# EAGLE design BLEModule (EAGLE 7.6.0)
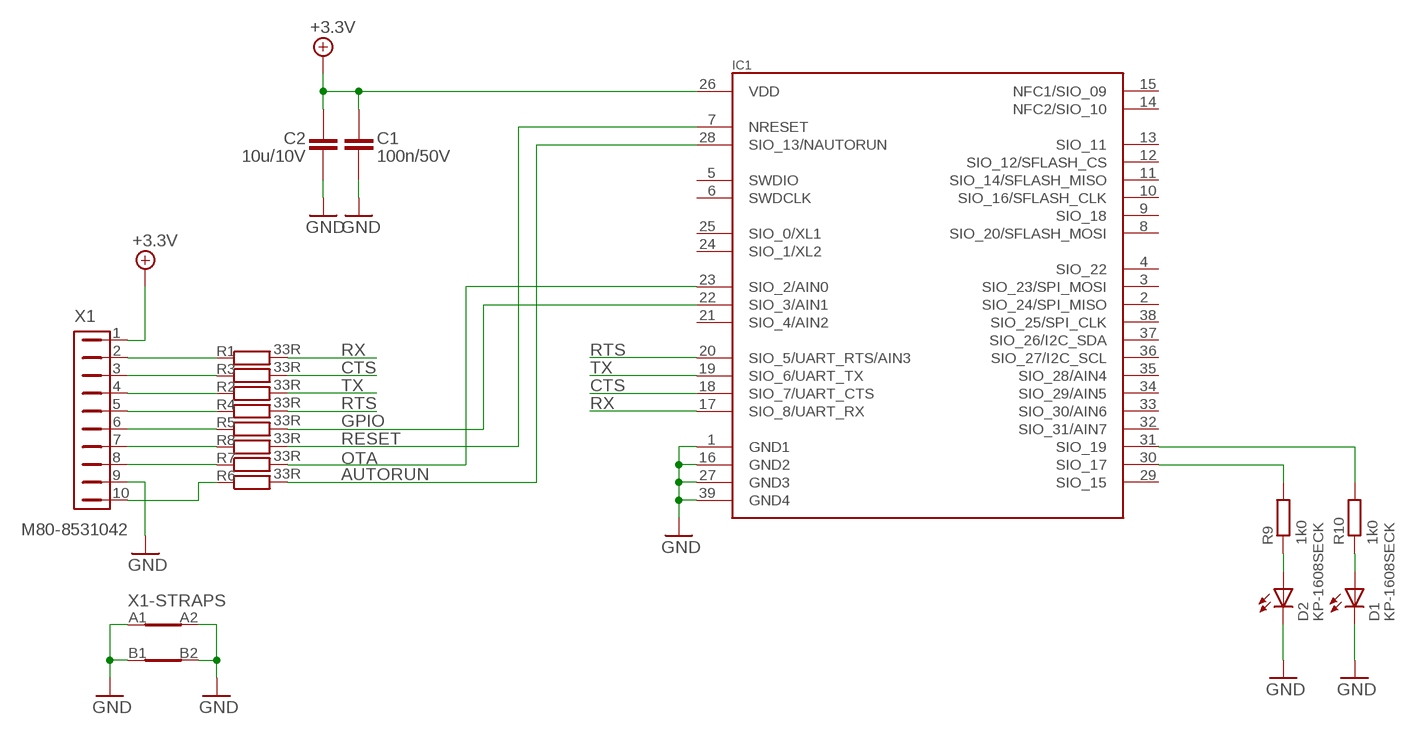
[diagram p0: schematic, sheet 1]

## Parts
C1  100N/50V,X7R,+/-10%_0603R  [C0603R]
C2  10U/10V,X5R,+/-20%_0603R  [C0603R]
D1  KP-1608SECK  [0603]
D2  KP-1608SECK  [0603]
IC1  BL652-SC-01  [BL652-SA]
R1  33R/0.1W,THICK_FILM,1%_0603R  [R0603R]
R2  33R/0.1W,THICK_FILM,1%_0603R  [R0603R]
R3  33R/0.1W,THICK_FILM,1%_0603R  [R0603R]
R4  33R/0.1W,THICK_FILM,1%_0603R  [R0603R]
R5  33R/0.1W,THICK_FILM,1%_0603R  [R0603R]
R6  33R/0.1W,THICK_FILM,1%_0603R  [R0603R]
R7  33R/0.1W,THICK_FILM,1%_0603R  [R0603R]
R8  33R/0.1W,THICK_FILM,1%_0603R  [R0603R]
R9  1K0/0.1W,THICK_FILM,1%_0603R  [R0603R]
R10  1K0/0.1W,THICK_FILM,1%_0603R  [R0603R]
X1  M80-8531042  M80-8531042-W_STRAPS  [M80-85310-W_STRAPS]

## Nets
+3.3V: C1.2 C2.2 IC1.26(VDD) X1.1
AUTORUN: IC1.28(SIO_13/NAUTORUN) R6.2
CTS: IC1.18(SIO_7/UART_CTS) R3.2
GND: C1.1 C2.1 D1.2(C) D2.2(C) IC1.1(GND1) IC1.16(GND2) IC1.27(GND3) IC1.39(GND4) X1.9 X1.A1 X1.A2 X1.B1 X1.B2
GPIO: IC1.22(SIO_3/AIN1) R5.2
N$1: R6.1 X1.10
N$2: R1.1 X1.2
N$3: R3.1 X1.3
N$4: R2.1 X1.4
N$5: R4.1 X1.5
N$6: R5.1 X1.6
N$7: R7.1 X1.8
N$8: R8.1 X1.7
N$10: D2.1(A) R9.1
N$12: D1.1(A) R10.1
N$13: IC1.30(SIO_17) R9.2
N$14: IC1.31(SIO_19) R10.2
OTA: IC1.23(SIO_2/AIN0) R7.2
RESET: IC1.7(NRESET) R8.2
RTS: IC1.20(SIO_5/UART_RTS/AIN3) R4.2
RX: IC1.17(SIO_8/UART_RX) R1.2
TX: IC1.19(SIO_6/UART_TX) R2.2
Unconnected: IC1.2(SIO_24/SPI_MISO) IC1.3(SIO_23/SPI_MOSI) IC1.4(SIO_22) IC1.5(SWDIO) IC1.6(SWDCLK) IC1.8(SIO_20/SFLASH_MOSI) IC1.9(SIO_18) IC1.10(SIO_16/SFLASH_CLK) IC1.11(SIO_14/SFLASH_MISO) IC1.12(SIO_12/SFLASH_CS) IC1.13(SIO_11) IC1.14(NFC2/SIO_10) IC1.15(NFC1/SIO_09) IC1.21(SIO_4/AIN2) IC1.24(SIO_1/XL2) IC1.25(SIO_0/XL1) IC1.29(SIO_15) IC1.32(SIO_31/AIN7) IC1.33(SIO_30/AIN6) IC1.34(SIO_29/AIN5) IC1.35(SIO_28/AIN4) IC1.36(SIO_27/I2C_SCL) IC1.37(SIO_26/I2C_SDA) IC1.38(SIO_25/SPI_CLK)

## Library data of the parts
C1 = 0-LIB_Capacitor_ceramic:100N; COMPONENT_PACKAGE: 0603; COMPONENT_TITLE: Capacitor ceramic; COMPONENT_VALUE: 100n/50V; LIB: ECAP-000019; LIB_REEL: ECAP-000129; NOTE: X7R, +/-10%
C2 = 0-LIB_Capacitor_ceramic:10U; COMPONENT_PACKAGE: 0603; COMPONENT_TITLE: Capacitor ceramic; COMPONENT_VALUE: 10u/10V; LIB: ECAP-000022; LIB_REEL: ECAP-000130; NOTE: X5R, +/-20%
D1 D2 = 0-LIB_LED:KP-1608?; COMPONENT_MANUFACTURER: Kingbright; COMPONENT_PACKAGE: 0603; COMPONENT_TITLE: LED Diode; COMPONENT_VALUE: KP-1608SECK; FARNELL: 8529850; LIB: ELED-000002; NOTE: Orange
IC1 = laird:BL652-SC-01; COMPONENT_VALUE: BL652-SC-01
R1-R8 = 0-LIB_Resistor:33R; COMPONENT_PACKAGE: 0603; COMPONENT_TITLE: Resistor; COMPONENT_VALUE: 33R; LIB: ERES-000051; LIB_REEL: ERES-000196; NOTE: 0.1W, Thick_Film, 1%
R9 R10 = 0-LIB_Resistor:1K0; COMPONENT_PACKAGE: 0603; COMPONENT_TITLE: Resistor; COMPONENT_VALUE: 1k0; LIB: ERES-000036; LIB_REEL: ERES-000200; NOTE: 0.1W, Thick_Film, 1%
X1 = 0-LIB_Connectors_Wire-To-Board_HARWIN:M80-?1042-W_STRAPS; COMPONENT_MANUFACTURER: HARWIN; COMPONENT_PACKAGE: 2mm, 2x5pins; COMPONENT_TITLE: Connector; COMPONENT_VALUE: M80-8531042; FARNELL: 1463000; LIB: ECON-000023; NOTE: Through Hole, Vertical

## Board
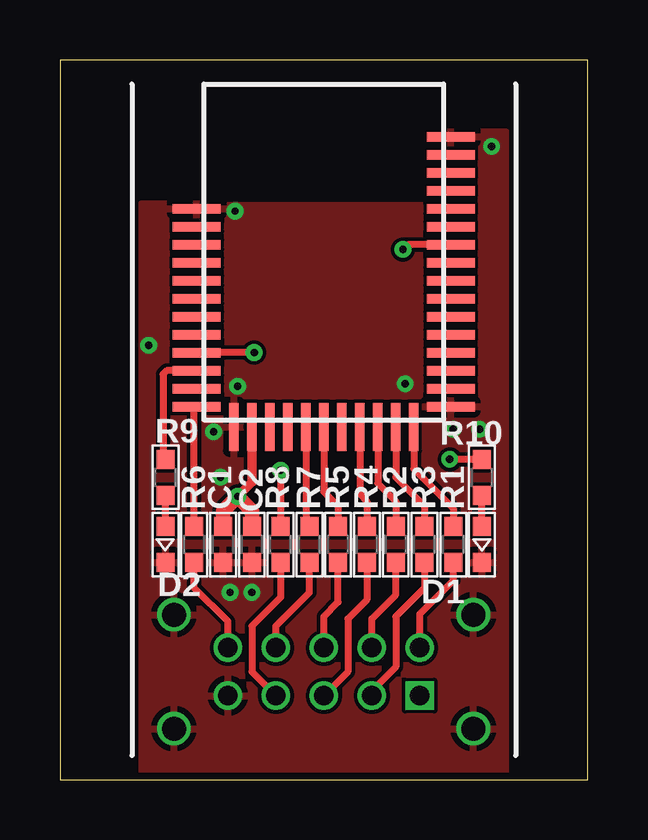
[diagram p1: board, top side]
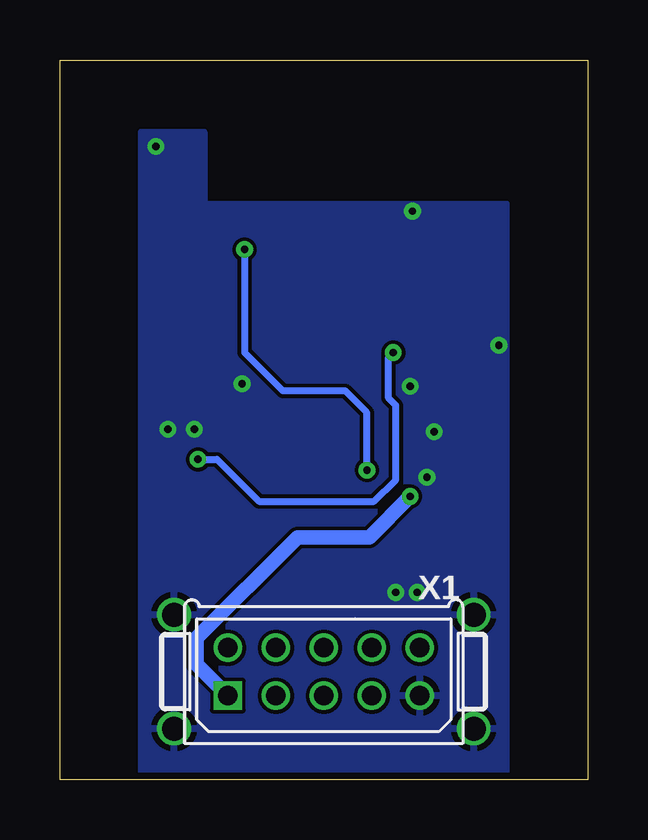
[diagram p2: board, bottom side, seen from below]

Size 22 x 30 mm. Coordinates in mm from the lower left corner, seen from the top.
Outline: 0,0 22,0 22,30 0,30 0,0
Copper layers (1+2*15+16): Top 0.018mm / dielectric 0.25mm / Route2 0.018mm / dielectric 0.4mm / Route15 0.018mm / dielectric 0.25mm / Bottom 0.018mm
Design rules "KC6benesov": minimum track width 0.15mm, minimum drill 0.3mm, track to track 0.15mm, track to pad 0.15mm, pad to pad 0.15mm, via to via 0.15mm, smd to smd 0.15mm, copper to edge 0.3mm, drill to drill 0.3mm, minimum pad ring 0.2mm, minimum via ring 0.2mm, stop-mask expansion 0mil, vias tented up to drill 0.4mm, thermal gap 10mil

### Footprints (pad centres in the part's own frame; a part is rotated, then mirrored left to right if it is on the bottom)
C0603R = smd 0.8 x 0.75: 1 -0.75,0; 2 0.75,0
0603 = smd 0.8 x 0.75: 1 -0.75,0; 2 0.75,0
BL652-SA = smd 2 x 0.4: 1 5.3,4.8; 2 5.3,4.05; 3 5.3,3.3; 4 5.3,2.55; 5 5.3,1.8; 6 5.3,1.05; 7 5.3,0.3; 8 5.3,-0.45; 9 5.3,-1.2; 10 5.3,-1.95; 11 5.3,-2.7; 12 5.3,-3.45; 13 5.3,-4.2; 14 5.3,-4.95; 15 5.3,-5.7; 16 5.3,-6.45; 28 -5.3,-6.45; 29 -5.3,-5.7; 30 -5.3,-4.95; 31 -5.3,-4.2; 32 -5.3,-3.45; 33 -5.3,-2.7; 34 -5.3,-1.95; 35 -5.3,-1.2; 36 -5.3,-0.45; 37 -5.3,0.3; 38 -5.3,1.05; 39 -5.3,1.8 | smd 0.4 x 2: 17 3.75,-7.3; 18 3,-7.3; 19 2.25,-7.3; 20 1.5,-7.3; 21 0.75,-7.3; 22 0,-7.3; 23 -0.75,-7.3; 24 -1.5,-7.3; 25 -2.25,-7.3; 26 -3,-7.3; 27 -3.75,-7.3
R0603R = smd 0.8 x 0.75: 1 -0.75,0; 2 0.75,0
M80-85310-W_STRAPS = drill 0.8 square: 1 4,1 | drill 0.8: 2 4,-1; 3 2,1; 4 2,-1; 5 0,1; 6 0,-1; 7 -2,1; 8 -2,-1; 9 -4,1; 10 -4,-1 | drill 1: A1 6.24,2.375; A2 6.24,-2.375; B1 -6.25,2.375; B2 -6.25,-2.375

### Placement (x,y rotation side)
C1  6.8,9.8 90 top
C2  8,9.8 90 top
D1  17.6,9.8 270 top
D2  4.4,9.8 270 top
IC1  11,22 0 top
R1  16.4,9.8 90 top
R2  14,9.8 90 top
R3  15.2,9.8 90 top
R4  12.8,9.8 90 top
R5  11.6,9.8 90 top
R6  5.6,9.8 90 top
R7  10.4,9.8 90 top
R8  9.2,9.8 90 top
R9  4.4,12.6 90 top
R10  17.6,12.6 90 top
X1  11,4.5 180 bottom

### Tracks (layer width: path | path; a pad name or v marks a point on that pad's centre or on a via)
+3.3V  (via drill 0.3)
  Top 0.4: IC1.26 8,12.4 v7.4,11.8
  Top 0.6: C1.2 6.8,11.2 v7.4,11.8 8,11.2 C2.2
  Bottom 0.6: X1.1 16.3,4.8 16.3,5.9 12.1,10.1 9.1,10.1 v7.4,11.8
AUTORUN
  Top 0.3: R6.2 5.6,15.45 IC1.28
CTS
  Top 0.3: IC1.18 14,12.6 15.2,11.4 R3.2
GND  (via drill 0.3)
  other vias: 7.1,7.8 8,7.8 6.4,14.5 6.7,12.6 7.4,16.4 7.3,23.7 16.4,14.6 17.5,14.6 3.7,18.1 18,26.4 14.4,16.5
  pour Top: 3.4,0 18.6,0 18.6,27 16,27 16,24 3.4,24
  pour Bottom: 3.4,0 18.6,0 18.6,27 16,27 16,24 3.4,24
GPIO
  Top 0.3: IC1.22 11,12 11.6,11.4 R5.2
N$1
  Top 0.3: X1.10 7,6.6 5.6,8 R6.1
N$2
  Top 0.3: X1.2 15,6.9 16.4,8.3 R1.1
N$3
  Top 0.3: R3.1 15.2,8 14,6.8 14,4.7 13,3.7 X1.3
N$4
  Top 0.3: X1.4 13,6.7 14,7.7 R2.1
N$5
  Top 0.3: R4.1 12.8,7.5 12,6.7 12,4.5 X1.5
N$6
  Top 0.3: X1.6 11,6.8 11.6,7.4 R5.1
N$7
  Top 0.3: X1.8 9,6.4 10.4,7.8 R7.1
N$8
  Top 0.3: R8.1 9.2,7.6 8,6.4 8,4.5 X1.7
N$10
  Top 0.3: D2.1 R9.1
N$12
  Top 0.3: D1.1 R10.1
N$13
  Top 0.3: IC1.30 4.45,17.05 4.3,16.9 4.3,13.45 R9.2
N$14  (via drill 0.3)
  Top 0.3: R10.2 v16.25,13.35 | v8.1,17.8 IC1.31
  Bottom 0.3: v16.25,13.35 15.45,13.35 13.7,11.6 8.9,11.6 8,12.5 8,15.6 8.3,15.9 8.3,17.6 v8.1,17.8
OTA
  Top 0.3: IC1.23 10.25,10.7 R7.2
RESET  (via drill 0.3)
  Top 0.3: IC1.7 14.5,22.3 v14.3,22.1 | v9.2,12.9 R8.2
  Bottom 0.3: v14.3,22.1 14.3,17.8 12.7,16.2 10.1,16.2 9.2,15.3 v9.2,12.9
RTS
  Top 0.3: IC1.20 12.5,11.9 12.8,11.6 R4.2
RX
  Top 0.3: IC1.17 14.75,12.95 16.4,11.3 R1.2
TX
  Top 0.3: IC1.19 13.25,12.35 14,11.6 R2.2